# Altium schematic sheet schematic.SchDoc
size A3; PageSetup: Record=PageOptions|CenterHorizontal=True|CenterVertical=True|PrintScale=1.00|XCorrection=1.00|YCorrection=1.00|PrintKind=1|BorderSize=5000000|LeftOffset=0|BottomOffset=0|Orientation=2|PaperLength=1000|PaperWidth=1000|Scale=100|PaperSource=7|PrintQuality=-3|MediaType=1|DitherType=10|PrintScaleMode=0|PaperKind=A4|PaperIndex=9
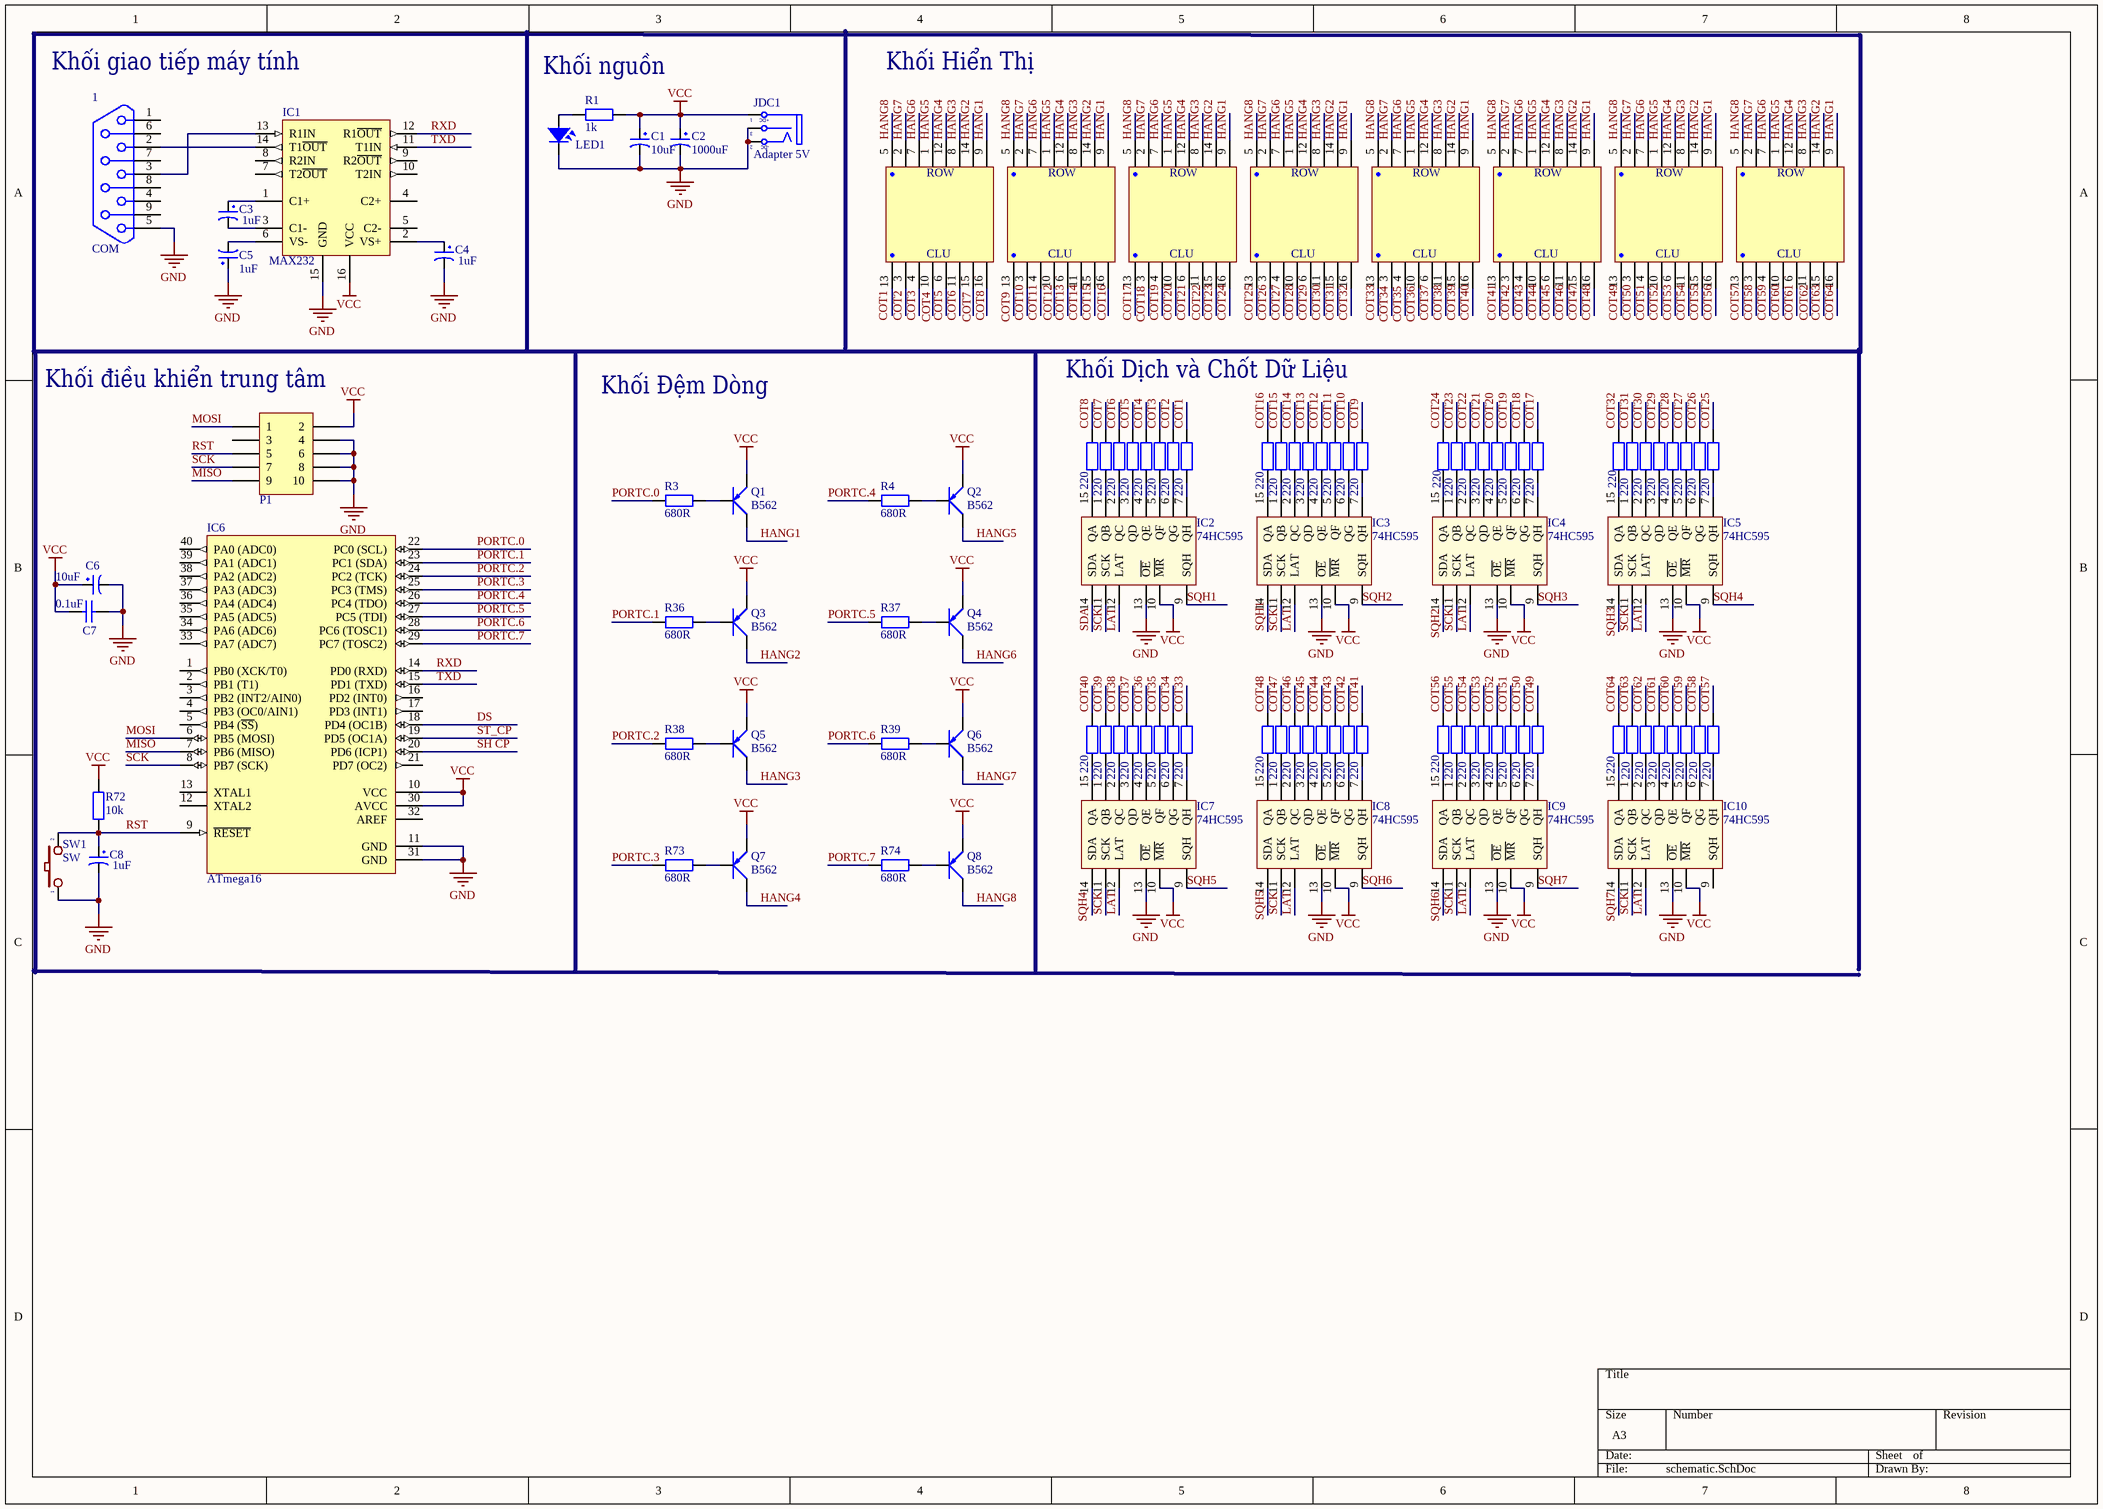
[diagram p0: schematic.SchDoc]

## Parts
1  COM  [DSB 9-F]
C1  10uF  [TU HOA 5mm]
C2  1000uF  [tu hoa 8mm]
C3  1uF  [TU HOA 5mm]
C4  1uF  [TU HOA 5mm]
C5  1uF  [TU HOA 5mm]
C6  10uF  [TU HOA 5mm]
C7  0.1uF  [tu gom]
C8  1uF  [TU HOA 5mm]
IC1  MAX232  [DIP16/W0.3]
IC2  74HC595  [DIP16]
IC3  74HC595  [DIP16]
IC4  74HC595  [DIP16]
IC5  74HC595  [DIP16]
IC6  ATmega16  [DIP40/W0.6]
IC7  74HC595  [DIP16]
IC8  74HC595  [DIP16]
IC9  74HC595  [DIP16]
IC10  74HC595  [DIP16]
JDC1  Adapter 5V  [DC-IN]
LED1  LED  [LED-3MM-YELLOW]  (value not drawn)
MT1  Matrix 8x8S  [Matrix]  (value not drawn)
MT2  Matrix 8x8S  [Matrix]  (value not drawn)
MT3  Matrix 8x8S  [Matrix]  (value not drawn)
MT4  Matrix 8x8S  [Matrix]  (value not drawn)
MT5  Matrix 8x8S  [Matrix]  (value not drawn)
MT6  Matrix 8x8S  [Matrix]  (value not drawn)
MT7  Matrix 8x8S  [Matrix]  (value not drawn)
MT8  Matrix 8x8S  [Matrix]  (value not drawn)
P1  5x2-Pin, Male  [IDC10]  (value not drawn)
Q1  B562  [QTO-92]
Q2  B562  [QTO-92]
Q3  B562  [QTO-92]
Q4  B562  [QTO-92]
Q5  B562  [QTO-92]
Q6  B562  [QTO-92]
Q7  B562  [QTO-92]
Q8  B562  [QTO-92]
R1  1k  [tro vach 1/4w]
R2  220  [tro vach 1/4w]
R3  680R  [tro vach 1/4w]
R4  680R  [tro vach 1/4w]
R5  220  [tro vach 1/4w]
R6  220  [tro vach 1/4w]
R7  220  [tro vach 1/4w]
R8  220  [tro vach 1/4w]
R9  220  [tro vach 1/4w]
R10  220  [tro vach 1/4w]
R11  220  [tro vach 1/4w]
R12  220  [tro vach 1/4w]
R13  220  [tro vach 1/4w]
R14  220  [tro vach 1/4w]
R15  220  [tro vach 1/4w]
R16  220  [tro vach 1/4w]
R17  220  [tro vach 1/4w]
R18  220  [tro vach 1/4w]
R19  220  [tro vach 1/4w]
R20  220  [tro vach 1/4w]
R21  220  [tro vach 1/4w]
R22  220  [tro vach 1/4w]
R23  220  [tro vach 1/4w]
R24  220  [tro vach 1/4w]
R25  220  [tro vach 1/4w]
R26  220  [tro vach 1/4w]
R27  220  [tro vach 1/4w]
R28  220  [tro vach 1/4w]
R29  220  [tro vach 1/4w]
R30  220  [tro vach 1/4w]
R31  220  [tro vach 1/4w]
R32  220  [tro vach 1/4w]
R33  220  [tro vach 1/4w]
R34  220  [tro vach 1/4w]
R35  220  [tro vach 1/4w]
R36  680R  [tro vach 1/4w]
R37  680R  [tro vach 1/4w]
R38  680R  [tro vach 1/4w]
R39  680R  [tro vach 1/4w]
R40  220  [tro vach 1/4w]
R41  220  [tro vach 1/4w]
R42  220  [tro vach 1/4w]
R43  220  [tro vach 1/4w]
R44  220  [tro vach 1/4w]
R45  220  [tro vach 1/4w]
R46  220  [tro vach 1/4w]
R47  220  [tro vach 1/4w]
R48  220  [tro vach 1/4w]
R49  220  [tro vach 1/4w]
R50  220  [tro vach 1/4w]
R51  220  [tro vach 1/4w]
R52  220  [tro vach 1/4w]
R53  220  [tro vach 1/4w]
R54  220  [tro vach 1/4w]
R55  220  [tro vach 1/4w]
R56  220  [tro vach 1/4w]
R57  220  [tro vach 1/4w]
R58  220  [tro vach 1/4w]
R59  220  [tro vach 1/4w]
R60  220  [tro vach 1/4w]
R61  220  [tro vach 1/4w]
R62  220  [tro vach 1/4w]
R63  220  [tro vach 1/4w]
R64  220  [tro vach 1/4w]
R65  220  [tro vach 1/4w]
R66  220  [tro vach 1/4w]
R67  220  [tro vach 1/4w]
R68  220  [tro vach 1/4w]
R69  220  [tro vach 1/4w]
R70  220  [tro vach 1/4w]
R71  220  [tro vach 1/4w]
R72  10k  [tro vach 1/4w]
R73  680R  [tro vach 1/4w]
R74  680R  [tro vach 1/4w]
SW1  SW  [SW2]

## Nets
GND: 1.5 C1.2 C2.2 C4.2 C5.1 C6.2 C7.1 C8.2 IC1.15(GND) IC2.8(GND) IC2.13(~{OE}) IC3.8(GND) IC3.13(~{OE}) IC4.8(GND) IC4.13(~{OE}) IC5.8(GND) IC5.13(~{OE}) IC6.11(GND) IC6.31(GND) IC7.8(GND) IC7.13(~{OE}) IC8.8(GND) IC8.13(~{OE}) IC9.8(GND) IC9.13(~{OE}) IC10.8(GND) IC10.13(~{OE}) JDC1.2(TN) JDC1.3(S) LED1.2 P1.4 P1.6 P1.8 P1.10 SW1.1
VCC: C1.1 C2.1 C6.1 C7.2 IC1.16(VCC) IC2.10(~{MR}) IC2.16(VCC) IC3.10(~{MR}) IC3.16(VCC) IC4.10(~{MR}) IC4.16(VCC) IC5.10(~{MR}) IC5.16(VCC) IC6.10(VCC) IC6.30(AVCC) IC7.10(~{MR}) IC7.16(VCC) IC8.10(~{MR}) IC8.16(VCC) IC9.10(~{MR}) IC9.16(VCC) IC10.10(~{MR}) IC10.16(VCC) JDC1.1(T) P1.2 Q1.1(E) Q2.1(E) Q3.1(E) Q4.1(E) Q5.1(E) Q6.1(E) Q7.1(E) Q8.1(E) R1.2 R72.2
COT1: R11.2
COT2: R10.2
COT3: R9.2
COT4: R8.2
COT5: R7.2
COT6: R6.2
COT7: R5.2
COT8: R2.2
COT9: R19.2
COT10: R18.2
COT11: R17.2
COT12: R16.2
COT13: R15.2
COT14: R14.2
COT15: R13.2
COT16: R12.2
COT17: R27.2
COT18: R26.2
COT19: R25.2
COT20: R24.2
COT21: R23.2
COT22: R22.2
COT23: R21.2
COT24: R20.2
COT25: R35.2
COT26: R34.2
COT27: R33.2
COT28: R32.2
COT29: R31.2
COT30: R30.2
COT31: R29.2
COT32: R28.2
COT33: R47.2
COT34: R46.2
COT35: R45.2
COT36: R44.2
COT37: R43.2
COT38: R42.2
COT39: R41.2
COT40: R40.2
COT41: R55.2
COT42: R54.2
COT43: R53.2
COT44: R52.2
COT45: R51.2
COT46: R50.2
COT47: R49.2
COT48: R48.2
COT49: R63.2
COT50: R62.2
COT51: R61.2
COT52: R60.2
COT53: R59.2
COT54: R58.2
COT55: R57.2
COT56: R56.2
COT57: R71.2
COT58: R70.2
COT59: R69.2
COT60: R68.2
COT61: R67.2
COT62: R66.2
COT63: R65.2
COT64: R64.2
DS: IC6.18(PD4_(OC1B))
HANG1: MT1.9(H8) MT2.9(H8) MT3.9(H8) MT4.9(H8) MT5.9(H8) MT6.9(H8) MT7.9(H8) MT8.9(H8) Q1.2(C)
HANG2: MT1.14(H7) MT2.14(H7) MT3.14(H7) MT4.14(H7) MT5.14(H7) MT6.14(H7) MT7.14(H7) MT8.14(H7) Q3.2(C)
HANG3: MT1.8(H6) MT2.8(H6) MT3.8(H6) MT4.8(H6) MT5.8(H6) MT6.8(H6) MT7.8(H6) MT8.8(H6) Q5.2(C)
HANG4: MT1.12(H5) MT2.12(H5) MT3.12(H5) MT4.12(H5) MT5.12(H5) MT6.12(H5) MT7.12(H5) MT8.12(H5) Q7.2(C)
HANG5: MT1.1(H4) MT2.1(H4) MT3.1(H4) MT4.1(H4) MT5.1(H4) MT6.1(H4) MT7.1(H4) MT8.1(H4) Q2.2(C)
HANG6: MT1.7(H3) MT2.7(H3) MT3.7(H3) MT4.7(H3) MT5.7(H3) MT6.7(H3) MT7.7(H3) MT8.7(H3) Q4.2(C)
HANG7: MT1.2(H2) MT2.2(H2) MT3.2(H2) MT4.2(H2) MT5.2(H2) MT6.2(H2) MT7.2(H2) MT8.2(H2) Q6.2(C)
HANG8: MT1.5(H1) MT2.5(H1) MT3.5(H1) MT4.5(H1) MT5.5(H1) MT6.5(H1) MT7.5(H1) MT8.5(H1) Q8.2(C)
LAT: IC2.12(LAT) IC3.12(LAT) IC4.12(LAT) IC5.12(LAT) IC7.12(LAT) IC8.12(LAT) IC9.12(LAT) IC10.12(LAT)
MISO: IC6.7(PB6_(MISO)) P1.9
MOSI: IC6.6(PB5_(MOSI)) P1.1
PORTC.0: IC6.22(PC0_(SCL)) R3.1
PORTC.1: IC6.23(PC1_(SDA)) R36.1
PORTC.2: IC6.24(PC2_(TCK)) R38.1
PORTC.3: IC6.25(PC3_(TMS)) R73.1
PORTC.4: IC6.26(PC4_(TDO)) R4.1
PORTC.5: IC6.27(PC5_(TDI)) R37.1
PORTC.6: IC6.28(PC6_(TOSC1)) R39.1
PORTC.7: IC6.29(PC7_(TOSC2)) R74.1
RST: C8.1 IC6.9(~{RESET}) P1.5 R72.1 SW1.2
RXD: IC1.12(R1~{OUT}) IC6.14(PD0_(RXD))
SCK: IC2.11(SCK) IC3.11(SCK) IC4.11(SCK) IC5.11(SCK) IC6.8(PB7_(SCK)) IC7.11(SCK) IC8.11(SCK) IC9.11(SCK) IC10.11(SCK) P1.7
SDA: IC2.14(SDA)
SH CP: IC6.20(PD6_(ICP1))
SQH1: IC2.9(SQH) IC3.14(SDA)
SQH2: IC3.9(SQH)
SQH3: IC4.9(SQH)
SQH4: IC5.9(SQH)
SQH5: IC7.9(SQH)
SQH6: IC8.9(SQH)
SQH7: IC9.9(SQH)
ST_CP: IC6.19(PD5_(OC1A))
TXD: IC1.11(T1IN) IC6.15(PD1_(TXD))
Net1_2: 1.2 IC1.14(T1~{OUT})
Net1_3: 1.3 IC1.13(R1IN)
NetC3_1: C3.1 IC1.1(C1+)
NetC3_2: C3.2 IC1.3(C1-)
NetC4_1: C4.1 IC1.2(VS+)
NetC5_2: C5.2 IC1.6(VS-)
NetIC2_1: IC2.1(QB) R5.1
NetIC2_2: IC2.2(QC) R6.1
NetIC2_3: IC2.3(QD) R7.1
NetIC2_4: IC2.4(QE) R8.1
NetIC2_5: IC2.5(QF) R9.1
NetIC2_6: IC2.6(QG) R10.1
NetIC2_7: IC2.7(QH) R11.1
NetIC2_15: IC2.15(QA) R2.1
NetIC3_1: IC3.1(QB) R13.1
NetIC3_2: IC3.2(QC) R14.1
NetIC3_3: IC3.3(QD) R15.1
NetIC3_4: IC3.4(QE) R16.1
NetIC3_5: IC3.5(QF) R17.1
NetIC3_6: IC3.6(QG) R18.1
NetIC3_7: IC3.7(QH) R19.1
NetIC3_15: IC3.15(QA) R12.1
NetIC4_1: IC4.1(QB) R21.1
NetIC4_2: IC4.2(QC) R22.1
NetIC4_3: IC4.3(QD) R23.1
NetIC4_4: IC4.4(QE) R24.1
NetIC4_5: IC4.5(QF) R25.1
NetIC4_6: IC4.6(QG) R26.1
NetIC4_7: IC4.7(QH) R27.1
NetIC4_15: IC4.15(QA) R20.1
NetIC5_1: IC5.1(QB) R29.1
NetIC5_2: IC5.2(QC) R30.1
NetIC5_3: IC5.3(QD) R31.1
NetIC5_4: IC5.4(QE) R32.1
NetIC5_5: IC5.5(QF) R33.1
NetIC5_6: IC5.6(QG) R34.1
NetIC5_7: IC5.7(QH) R35.1
NetIC5_15: IC5.15(QA) R28.1
NetIC7_1: IC7.1(QB) R41.1
NetIC7_2: IC7.2(QC) R42.1
NetIC7_3: IC7.3(QD) R43.1
NetIC7_4: IC7.4(QE) R44.1
NetIC7_5: IC7.5(QF) R45.1
NetIC7_6: IC7.6(QG) R46.1
NetIC7_7: IC7.7(QH) R47.1
NetIC7_15: IC7.15(QA) R40.1
NetIC8_1: IC8.1(QB) R49.1
NetIC8_2: IC8.2(QC) R50.1
NetIC8_3: IC8.3(QD) R51.1
NetIC8_4: IC8.4(QE) R52.1
NetIC8_5: IC8.5(QF) R53.1
NetIC8_6: IC8.6(QG) R54.1
NetIC8_7: IC8.7(QH) R55.1
NetIC8_15: IC8.15(QA) R48.1
NetIC9_1: IC9.1(QB) R57.1
NetIC9_2: IC9.2(QC) R58.1
NetIC9_3: IC9.3(QD) R59.1
NetIC9_4: IC9.4(QE) R60.1
NetIC9_5: IC9.5(QF) R61.1
NetIC9_6: IC9.6(QG) R62.1
NetIC9_7: IC9.7(QH) R63.1
NetIC9_15: IC9.15(QA) R56.1
NetIC10_1: IC10.1(QB) R65.1
NetIC10_2: IC10.2(QC) R66.1
NetIC10_3: IC10.3(QD) R67.1
NetIC10_4: IC10.4(QE) R68.1
NetIC10_5: IC10.5(QF) R69.1
NetIC10_6: IC10.6(QG) R70.1
NetIC10_7: IC10.7(QH) R71.1
NetIC10_15: IC10.15(QA) R64.1
NetLED1_1: LED1.1 R1.1
NetQ1_3: Q1.3(B) R3.2
NetQ2_3: Q2.3(B) R4.2
NetQ3_3: Q3.3(B) R36.2
NetQ4_3: Q4.3(B) R37.2
NetQ5_3: Q5.3(B) R38.2
NetQ6_3: Q6.3(B) R39.2
NetQ7_3: Q7.3(B) R73.2
NetQ8_3: Q8.3(B) R74.2

Not connected (* = marked no-connect by the designer): 1 1 4 6 7 8 9; IC1 4(C2+) 5(C2-) 7(T2~{OUT}) 8(R2IN) 9(R2~{OUT}) 10(T2IN); IC4 14(SDA); IC5 14(SDA); IC6 1(PB0_(XCK/T0)) 2(PB1_(T1)) 3(PB2_(INT2/AIN0)) 4(PB3_(OC0/AIN1)) 5(PB4_(~{SS})) 12(XTAL2) 13(XTAL1) 16(PD2_(INT0)) 17(PD3_(INT1)) 21(PD7_(OC2)) 32(AREF) 33(PA7_(ADC7)) 34(PA6_(ADC6)) 35(PA5_(ADC5)) 36(PA4_(ADC4)) 37(PA3_(ADC3)) 38(PA2_(ADC2)) 39(PA1_(ADC1)) 40(PA0_(ADC0)); IC7 14(SDA); IC8 14(SDA); IC9 14(SDA); IC10 9(SQH) 14(SDA); MT1 3(C2) 4(C3) 6(C5) 10(C4) 11(C6) 13(C1) 15(C7) 16(C8); MT2 3(C2) 4(C3) 6(C5) 10(C4) 11(C6) 13(C1) 15(C7) 16(C8); MT3 3(C2) 4(C3) 6(C5) 10(C4) 11(C6) 13(C1) 15(C7) 16(C8); MT4 3(C2) 4(C3) 6(C5) 10(C4) 11(C6) 13(C1) 15(C7) 16(C8); MT5 3(C2) 4(C3) 6(C5) 10(C4) 11(C6) 13(C1) 15(C7) 16(C8); MT6 3(C2) 4(C3) 6(C5) 10(C4) 11(C6) 13(C1) 15(C7) 16(C8); MT7 3(C2) 4(C3) 6(C5) 10(C4) 11(C6) 13(C1) 15(C7) 16(C8); MT8 3(C2) 4(C3) 6(C5) 10(C4) 11(C6) 13(C1) 15(C7) 16(C8); P1 3

## Notes on the sheet
- Khối giao tiếp máy tính
- Khối nguồn
- Khối Hiển Thị
- Khối Dịch và Chốt Dữ Liệu
- (near P1) Khối điều khiển trung tâm
- Khối Đệm Dòng
- Labels drawn without touching a wire or pin: COT1, COT2, COT3, COT4, COT5, COT6, COT7, COT8, COT9, COT10, COT11, COT12, COT13, COT14, COT15, COT16, COT17, COT18, COT19, COT20, COT21, COT22, COT23, COT24, COT25, COT26, COT27, COT28, COT29, COT30, COT31, COT32, COT33, COT34, COT35, COT36, COT37, COT38, COT39, COT40, COT41, COT42, COT43, COT44, COT45, COT46, COT47, COT48, COT49, COT50, COT51, COT52, COT53, COT54, COT55, COT56, COT57, COT58, COT59, COT60, COT61, COT62, COT63, COT64, SQH2, SQH3, SQH4, SQH5, SQH6, SQH7
- (in symbol Jac_DC) +DC; -DC
- (in symbol LED 8x8S) ROW; CLU

## Library data of the parts
C1 C3-C6 C8 = Tu Hoa 10uF 16V 4x7: Cắm; So_Chan: 2; Don_Vi: Con; Ten_Linh_Kien: Tụ Hóa 10uF 16V; Ma_Hang: MH006855; Chung_Loai: Cắm; Kieu_Chan: *
C2 = Tu Hoa 1000uF 16V 8x20: Cắm; Don_Vi: Con; So_Chan: 2; Ten_Linh_Kien: Tụ Hóa 1000uF 16V 8x20MM; Ma_Hang: MH008300; Chung_Loai: Cắm; Kieu_Chan: *
C7 = Tu gom 104 50V: Cắm; So_Chan: 2; Ten_Linh_Kien: Tụ gốm 104 100nF 50V; Don_Vi: Con; Ma_Hang: MH004761; Chung_Loai: Cắm; Kieu_Chan: *
IC1 = MAX232: Dual EIA-232 Driver/Receiver; Value: MAX232
IC2-IC5 IC7-IC10 = 74595: 8 Bit Serial input - Parallel Output; Value: 74HC595
IC6 = ATmega16A-PU: 8-Bit AVR Microcontroller with 16K Bytes of In-System Programmable Flash Memory; Value: Atmega 16L
JDC1 = Jac_DC: Cắm; Ten_Linh_Kien: Jack DC5.5x2.1MM DC5501; Ma_Hang: MH000923; Don_Vi: Con; Kieu_Chan: *; Ghi_Chu: *; Chung_Loai: Cắm
LED1 = LED: LED Single colour Green and Red; Value: LED 3 ly Single Colour
MT1-MT8 = LED 8x8S: Matrix 8x8,  Single colour; Value: Matrix 8x8S
P1 = Header 5x2M 1.27MM: MPN: 525673713482; CompanyID: VT-01107; Solder: HAND; Value: 5x2-Pin, Male
Q1-Q8 = A1015: PNP 600mW, ECB; Value: A1015
R1 = Tro Vach 1/4W 5% 1k: Cắm; Don_Vi: Con; So_Chan: 2; Ten_Linh_Kien: Trở Vạch 1/4w 5% 1k; Ma_Hang: MH007390; Chung_Loai: Cắm; Kieu_Chan: *
R2 R5-R35 R40-R71 = Tro Vach 1/4W 5% 220R: Cắm; Don_Vi: Con; So_Chan: 2; Ten_Linh_Kien: Trở Vạch 1/4w 5% 220R; Ma_Hang: MH007300; Chung_Loai: Cắm; Kieu_Chan: *
R3 R4 R36-R39 R73 R74 = Tro Vach 1/4W 5% 680R: Cắm; Don _Vi: Con; So_Chan: 2; Ten_Linh_Kien: Trở Vạch 1/4w 5% 680R; Ma_Hang: MH007331; Chung_Loai: Cắm; Kieu_Chan: *
R72 = Tro Vach 1/4W 1% 10k: Cắm; Don_Vi: Con; So_Chan: 2; Ten_Linh_Kien: Trở Vạch 1/4w 1% 10k; Ma_Hang: MH006349; Chung_Loai: Cắm; Kieu_Chan: *
SW1 = SW2: Switch button 2 pin; Value: SW chip 2 pin